# Altium schematic sheet PowerScr.SchDoc: Power Scr Dextra
size A4 portrait; Author: Julio Alvarez D; DrawnBy: Julio Alvarez
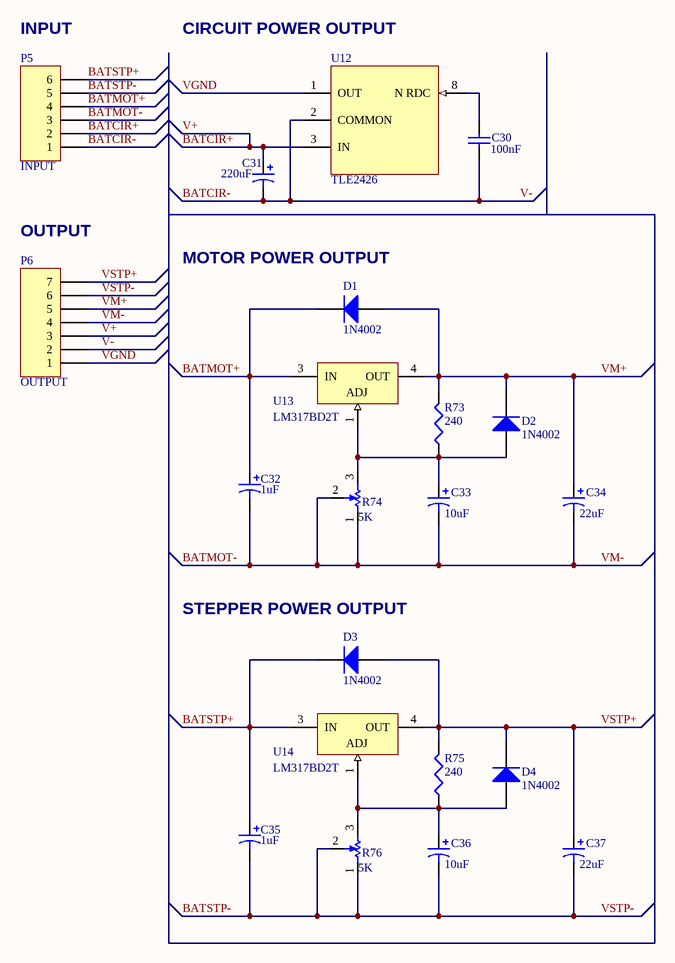
[diagram p0: PowerScr.SchDoc]

## Parts
C30  value 100nF  [RAD-0.2]  (hidden comment: Cap)
C31  value 220uF  [C100UFB]  (hidden comment: Cap Pol1)
C32  value 1uF  [3528]  (hidden comment: 593D105X0020B2)
C33  value 10uF  [7343]  (hidden comment: 593D226X0020D2)
C34  value 22uF  [7343]  (hidden comment: 593D226X0020D2)
C35  value 1uF  [3528]  (hidden comment: 593D105X0020B2)
C36  value 10uF  [7343]  (hidden comment: 593D226X0020D2)
C37  value 22uF  [7343]  (hidden comment: 593D226X0020D2)
D1  1N4002  [DO-41]
D2  1N4002  [DO-41]
D3  1N4002  [DO-41]
D4  1N4002  [DO-41]
P5  INPUT  [AZUL5-6]
P6  OUTPUT  [AZUL5-7]
R73  value 240  [RESC6332M]  (hidden comment: Res3)
R74  value 5K  [3361P]  (hidden comment: POT3361)
R75  value 240  [RESC6332M]  (hidden comment: Res3)
R76  value 5K  [3361P]  (hidden comment: POT3361)
U12  TLE2426  [SOP8 - duplicate]
U13  LM317BD2T  [936-03]
U14  LM317BD2T  [936-03]

## Nets
BATCIR+: C31.1 P5.2 P6.3 U12.3(IN)  [also labelled V+]
BATCIR-: C30.1 C31.2 P5.1 P6.2 U12.2(COMMON)  [also labelled V-]
BATMOT+: C32.1 D1.2(K) P5.4 U13.3(IN)
BATMOT-: C32.2 C33.2 C34.2 P5.3 P6.4 R74.1 R74.2  [also labelled VM-]
BATSTP+: C35.1 D3.2(K) P5.6 U14.3(IN)
BATSTP-: C35.2 C36.2 C37.2 P5.5 P6.6 R76.1 R76.2  [also labelled VSTP-]
VGND: P6.1 U12.1(OUT)
VM+: C34.1 D1.1(A) D2.2(K) P6.5 R73.2 U13.4(OUT)
VSTP+: C37.1 D3.1(A) D4.2(K) P6.7 R75.2 U14.4(OUT)
NetC30_2: C30.2 U12.8(N_RDC)
NetC33_1: C33.1 D2.1(A) R73.1 R74.3 U13.1(ADJ)
NetC36_1: C36.1 D4.1(A) R75.1 R76.3 U14.1(ADJ)

Not connected (* = marked no-connect by the designer): U12 4(NC) 5(NC) 6(NC) 7(NC)

## Notes on the sheet
- (near P5) INPUT
- CIRCUIT POWER OUTPUT
- (near P6) OUTPUT
- MOTOR POWER OUTPUT
- (near D3) STEPPER POWER OUTPUT

## Library data of the parts
C30 = Cap: Capacitor; Published: 8-Jun-2000; LatestRevisionDate: 17-Jul-2002; LatestRevisionNote: Re-released for DXP Platform.; PackageReference: RAD-0.3; Publisher: Altium Limited; PackageDescription: Radial Cap, Thru-Hole; 2 Leads; 0.3 in Pin Spacing
C31 = Cap Pol1: Polarized Capacitor (Radial); Published: 8-Jun-2000; LatestRevisionDate: 17-Jul-2002; LatestRevisionNote: Re-released for DXP Platform.; PackageReference: RB7.6-15; Publisher: Altium Limited; PackageDescription: Polarized Capacitor (Radial); 2 Leads
C32 C35 = 593D106X0020B2: Tantamount Commercial, Surface Mount Solid Tantalum Chip Capacitor for Switch Mode Power Supplies and Converters: 10uF, 20% Tolerance, 20 WVDC @ +85°C, Surge = 26V; Note: See Data Sheet for full range of components; Published: 19-Mar-2004; DatasheetDocument: 04-Mar-2003; PackageReference: 3528; Publisher: Altium Limited; Code_JEITA: 3528; ComponentLink1Description: Manufacturer Link; ComponentLink1URL: http://www.vishay.com/; ComponentLink2Description: Datasheet; ComponentLink2URL: http://www.vishay.com/docs/40005/593.pdf
C33 C34 C36 C37 = 593D226X0020D2: Tantamount Commercial, Surface Mount Solid Tantalum Chip Capacitor for Switch Mode Power Supplies and Converters: 22uF, 20% Tolerance, 20 WVDC @ +85°C, Surge = 26V; Note: See Data Sheet for full range of components; Published: 19-Mar-2004; DatasheetDocument: 04-Mar-2003; PackageReference: 7343; Publisher: Altium Limited; Code_JEITA: 7343; ComponentLink1Description: Manufacturer Link; ComponentLink1URL: http://www.vishay.com/; ComponentLink2Description: Datasheet; ComponentLink2URL: http://www.vishay.com/docs/40005/593.pdf
D1-D4 = Diode 1N4002: 1 Amp General Purpose Rectifier; Published: 8-Jun-2000; LatestRevisionDate: 17-Jul-2002; LatestRevisionNote: Re-released for DXP Platform.; DatasheetVersion: 1998; PackageVersion: Aug-1999; PackageReference: DO-41; Publisher: Altium Limited; PackageDescription: Diode, Axial; Body 5.2 x 2.7 mm (LxDia. max), Lead Dia. 0.86 mm (max); Code_JEDEC: DO-204-AL; ComponentLink1Description: Manufacturer Link; ComponentLink1URL: http://www.fairchildsemi.com/; ComponentLink2Description: Datasheet; ComponentLink2URL: http://www.fairchildsemi.com/ds/1N%2F1N4001.pdf
P5 = Header 6: Header, 6-Pin; LatestRevisionDate: 17-Jul-2002; LatestRevisionNote: Re-released for DXP Platform.; Publisher: Altium Limited
P6 = Header 7: Header, 7-Pin; LatestRevisionDate: 17-Jul-2002; LatestRevisionNote: Re-released for DXP Platform.; Publisher: Altium Limited
R73 R75 = Res3: Resistor; Published: 8-Jun-2000; LatestRevisionDate: 29-May-2009; LatestRevisionNote: IPC-7351 Footprint Added.; PackageReference: J1-0603; Publisher: Altium Limited; PackageDescription: Chip Resistor
U12 = TLE2426: Precision Virtual Ground
U13 U14 = LM317BD2T: Three-Terminal Adjustable Output Positive Voltage Regulator; Note: Pin 2 is electrically connected to Pin 4; Pin 4 is heasink; Published: 15-Apr-2002; DatasheetVersion: 1996; PackageVersion: 1997; PackageReference: 936-03; Publisher: Altium Limited; PackageDescription: D2-PAK/TO-263-AB; 3 Leads (1 Cropped); Body 14.7 (inc. leads) x 10.2 mm (LxW max); ComponentLink1Description: Manufacturer Link; ComponentLink1URL: http://www.onsemi.com/site/products/taxonomy/0,4438,503,00.html; ComponentLink2Description: Datasheet; ComponentLink2URL: http://www.onsemi.com/pub/Collateral/LM317-D.PDF